# Altium schematic sheet SENSOR.SchDoc
size A4; SheetNumber: 4; SheetTotal: 5; SPICEModelCacheALUSSDSW: <root> / <DocumentId>ALUSSDSW</DocumentId> / <CacheFrame Number="0"> / <Model Name="gmk105bj104_v-f" Kind="CKT"> / <Text>* GMK105BJ104_V-F     SPICE MODEL  ( General Type ) / *-------------------------------------------------------------------------------------------------------- / * Model Generated by TAIYO YUDEN Corporation (http://www.ty-top.com) / * Version 1.0 / * TAIYO YUDEN Control No. 170508_061226 / * Copyright(c) 2012 TAIYO YUDEN CO.,LTD. All Rights Reserved. / *-------------------------------------------------------------------------------------------------------- / * / * Products Name : Multilayer Ceramic Capacitors / * / * Characteristics : / *     Capacitance : 0.1 uF , Rated Voltage : 35V , TCC : B / X5R / *     Case Size : 1.0 x 0.5 / 0.039 x 0.02 [mm/inch] , Thickness : 0.5 / 0.02 [mm/inch] / *     (Conditions: Temperature = 25 degC , DC Bias Current/Voltage = 0A / 0V) / * / * Frequency Range : 40Hz - 3GHz / * / * External Node Assignments : / * / *  1  o---| |---o  2 / * / *-------------------------------------------------------------------------------------------------------- / .SubCkt GMK105BJ104_V-F 1 2 / **************************** / C0 1 110 0.070351u / Cm 1 101 0.016111u / C1 101 102 0.069296u / Rc1 101 102 16.146k / C2 102 103 0.030776u / Rc2 102 103 344.14 / C3 103 110 0.021195u / Rc3 103 110 5.1627 / C2m 1 301 0.020847u / C21 301 302 0.28927u / Rc21 301 302 15.286k / C22 302 303 0.26628u / Rc22 302 303 12.239k / C23 303 304 0.21132u / Rc23 303 304 15.145k / C24 304 305 0.078855u / Rc24 304 305 2.6688k / C25 305 306 0.20986u / Rc25 305 306 330.59 / C26 306 307 0.078155u / Rc26 306 307 723.11 / C27 307 308 0.029921u / Rc27 307 308 64.708 / C28 308 309 0.019548u / Rc28 308 309 24.402 / C29 309 110 1666p / Rc29 309 110 0.83666 / Rp0 1 110 5G / L0 110 120 0.25789n / Lm 120 130 0.093457n / L1 120 121 1.1632p / RL1 121 130 0.63209 / L2 120 122 2.3124p / RL2 122 130 1.1301 / L3 120 123 6.01p / RL3 123 130 4.6768 / CR 120 124 0.022616u / LR 124 125 0.050216n / RR 125 130 0.12272 / CL 130 140 1.7584p / LL 130 140 0.19044n / RL 130 140 98.661 / Rs 140 2 25.54m / **************************** / .ends GMK105BJ104_V-F</Text> / </Model> / </CacheFrame> / </root>
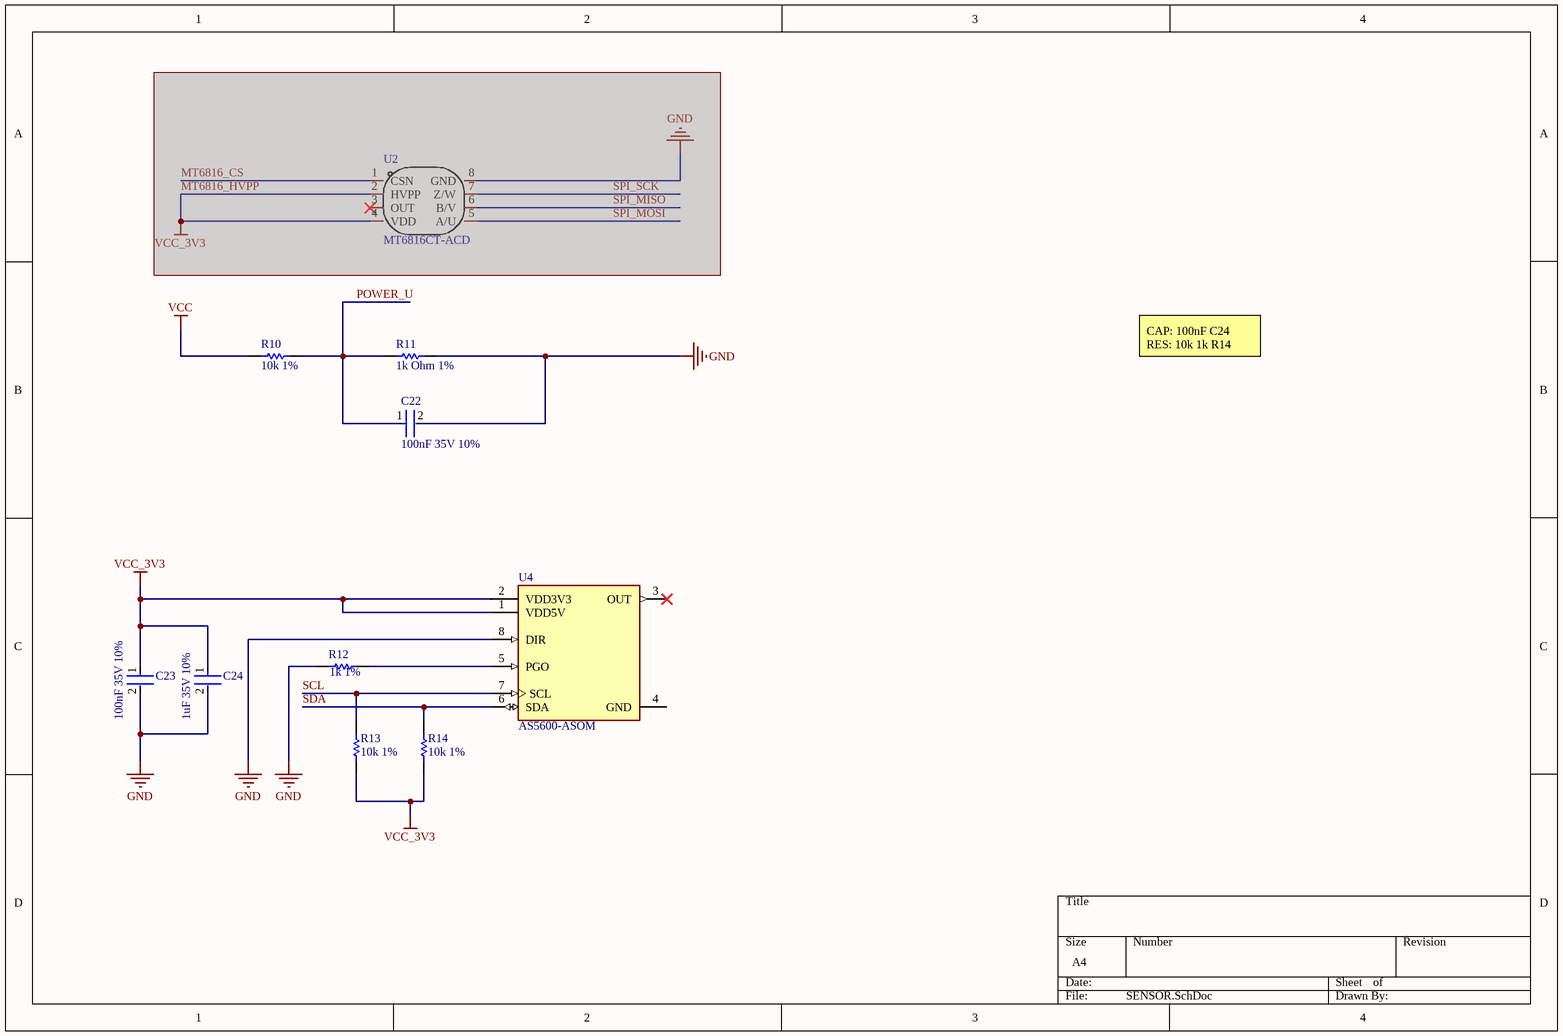
[diagram p0: SENSOR.SchDoc]

## Parts
C22  100nF 35V 10%  [FP-0402-L_1_0_0_05-W_0_5-IPC_A]
C23  100nF 35V 10%  [FP-0402-L_1_0_0_05-W_0_5-IPC_A]
C24  1uF 35V 10%  [FP-0805-L_2_0_0_1-W_1_25-IPC_C]
R10  10k 1%  [RESC2013X70X40ML20T20]
R11  1k Ohm 1%  [RESC2013X60X35ML10T20]
R12  1k 1%  [RESC3216X70X50LL05T20]
R13  10k 1%  [RESC2013X70X40ML20T20]
R14  10k 1%  [RESC2013X70X40ML20T20]
U2  MT6816CT-ACD  [SOP-8_L5.0-W4.0-P1.27-LS6.0-BL]  (masked out: inside a compile mask, not in the netlist)
U4  AS5600-ASOM  [FP-AS5600-ASOM-IPC_C]

## Nets
GND: C22.2 C23.2 C24.2 R11.2 R12.1 U4.8(DIR)
VCC: R10.2
VCC_3V3: C23.1 C24.1 R13.1 R14.1 U4.1(VDD5V) U4.2(VDD3V3)
POWER_U: C22.1 R10.1 R11.1
SCL: R13.2 U4.7(SCL)
SDA: R14.2 U4.6(SDA)
NetR12_2: R12.2 U4.5(PGO)

Not connected (* = marked no-connect by the designer): U4 3(OUT)* 4(GND)

## Notes on the sheet
- CAP: 100nF C24
  RES: 10k 1k R14

## Library data of the parts
C22 C23 = CMP-2000-06323-3: Dielectric: X5R; Voltage: 35V; Voltage Rating: 35V; Halogen Free: Halogen Free; Mount: Surface Mount; Max Operating Temperature: 85°C; Width: 0.02inch; Tolerance: 10%; Min Operating Temperature: -55°C; Length: 1mm; REACH SVHC: No SVHC; Voltage Rating (DC): 35V; Resistor Type: Ceramic; Radiation Hardening: No; Series: M; Termination: SMD/SMT; RoHS Compliant: Yes; Case/Package: 0402; Height: 0.5mm; Packaging: Tape and Reel; Construction: Flat; Capacitance: 100nF; Case Code (Metric): 1005; Case Code (Imperial): 0402; Depth: 0.5mm; Number of Pins: 2; Package Quantity: 1; Thickness: 0.022inch
C24 = CMP-14477-004038-2: Multilayer Ceramic Capacitor 1 uF 35V X7R 10% SMD 0805 T/R; Contact Plating: Nickel; Voltage: 35V; Height: 1.25mm; Width: 0.049inch; Voltage Rating: 35V; Depth: 1.25mm; Capacitance: 1uF; Packaging: Tape and Reel; Radiation Hardening: No; Min Operating Temperature: -55°C; Series: M; Halogen Free: Halogen Free; Thickness: 0.053inch; Termination: SMD/SMT; Length: 2mm; Lead Free: Lead Free; Case/Package: 0805; Construction: Flat; RoHS Compliant: Yes; Tolerance: 10%; Package Quantity: 1; Max Operating Temperature: 125°C; Number of Pins: 2; Voltage Rating (DC): 35V; Case Code (Imperial): 0805; Case Code (Metric): 2012; Dielectric: X7R; Mount: Surface Mount
R10 R13 R14 = CMP-2001-04376-1: Manufacturer: Panasonic; Part Number: ERJ-6ENF1002V
R11 = CMP-2100-03671-1: Chip Resistor, 1 KOhm, +/- 1%, 125 mW, -55 to 155 degC, 0805 (2012 Metric), RoHS, Tape and Reel; Manufacturer: Yageo; Temperature Coefficient: 100ppm/degreesC; Voltage Rating (DC): 150V; Max Power Dissipation: 125mW; Resistance: 1KOhm; Number of Pins: 2; Number of Terminations: 2; Datasheet URL: http://www.yageo.com/NewPortal/yageodocoutput?fileName=/pdf/R-Chip/PYu-RC_Group_51_RoHS_L_5.pdf; Length: 0.079inch; Package Description: 2-Pin Surface Mounted Device, Body 2 x 1.25 mm; Depth: 1.25mm; Height: 0.024inch; Military Standard: Not; Case/Package: 0805; Package Reference: 0805; RoHSCompliant: true; Lead Free: LeadFree; Packaging: TapeandReel; Package Quantity: 1; Datasheet Version: Rev. 5, 10/2016; Tolerance: 1%; Min Operating Temperature: -55degC; Voltage Rating: 150V; Composition: ThickFilm; Case Code (Imperial): 0805; Power Rating: 125mW; Width: 0.049inch; Case Code (Metric): 2012; Manufacturer URL: http://www.yageo.com/; Max Operating Temperature: 155degC; REACH SVHC: Unknown; Termination: SMD/SMT
R12 = CMP-2003-00017-1: Manufacturer: Panasonic; Part Number: ERJ-8ENF1001V
U2 = MT6816CT-ACD: AB=1024线，Z=4LSB，PWM=1KHz; Manufacturer: MagnTek(麦歌恩); Add into BOM: yes; Symbol: MT6816CT-ACD; Device: MT6816CT-ACD; LCSC Part Name: 零延迟磁角位置传感器IC; Supplier Part: C879560; Manufacturer Part: MT6816CT-ACD; Supplier Footprint: SOP-8; JLCPCB Part Class: 扩展库; Datasheet: https://atta.szlcsc.com/upload/public/pdf/source/20201027/C879560_21F27A21E71569DDEA564795613A647F.pdf; Supplier: LCSC; Convert to PCB: yes
U4 = CMP-22826-000002-1: SENSOR ANGLE 360DEG SMD; Sensing Method: Hall Effect; Termination: SMD/SMT; Min Operating Temperature: -40°C; Mount: Surface Mount; Lead Free: Lead Free; Max Operating Temperature: 125°C